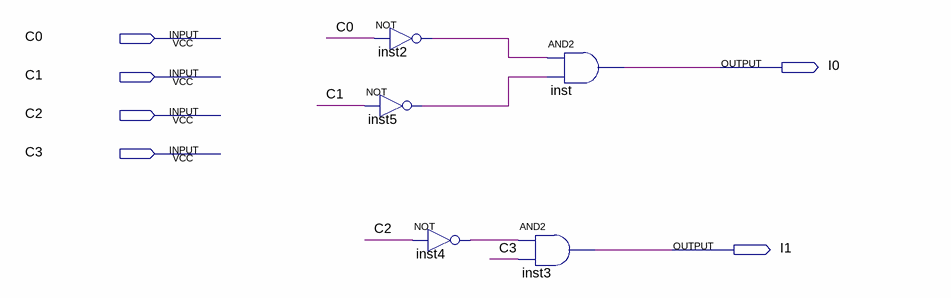
[diagram p0: schematic sheet]
// Quartus schematic CD4.bdf as structural Verilog: 5 symbols, 6 pins
module CD4 (
  input  C0,
  input  C1,
  input  C2,
  input  C3,
  output I0,
  output I1
);

  wire inst2_out, inst4_out, inst5_out;

  not inst5 (inst5_out, C1);
  not inst2 (inst2_out, C0);
  not inst4 (inst4_out, C2);
  and inst3 (I1, inst4_out, C3);
  and inst (I0, inst2_out, inst5_out);
endmodule
